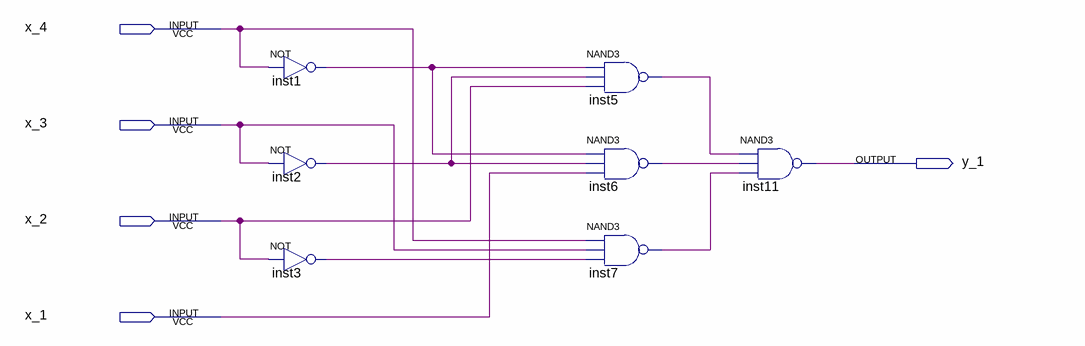
[diagram p0: schematic sheet]
// Quartus schematic lab1.bdf as structural Verilog: 7 symbols, 5 pins
module lab1 (
  input  x_4,
  input  x_3,
  input  x_2,
  input  x_1,
  output y_1
);

  wire inst1_out, inst2_out, inst3_out, inst5_out, inst6_out, inst7_out;

  not inst1 (inst1_out, x_4);
  not inst2 (inst2_out, x_3);
  not inst3 (inst3_out, x_2);
  nand inst5 (inst5_out, inst1_out, inst2_out, x_2);
  nand inst6 (inst6_out, inst1_out, inst2_out, x_1);
  nand inst7 (inst7_out, x_4, x_3, inst3_out);
  nand inst11 (y_1, inst5_out, inst6_out, inst7_out);
endmodule
